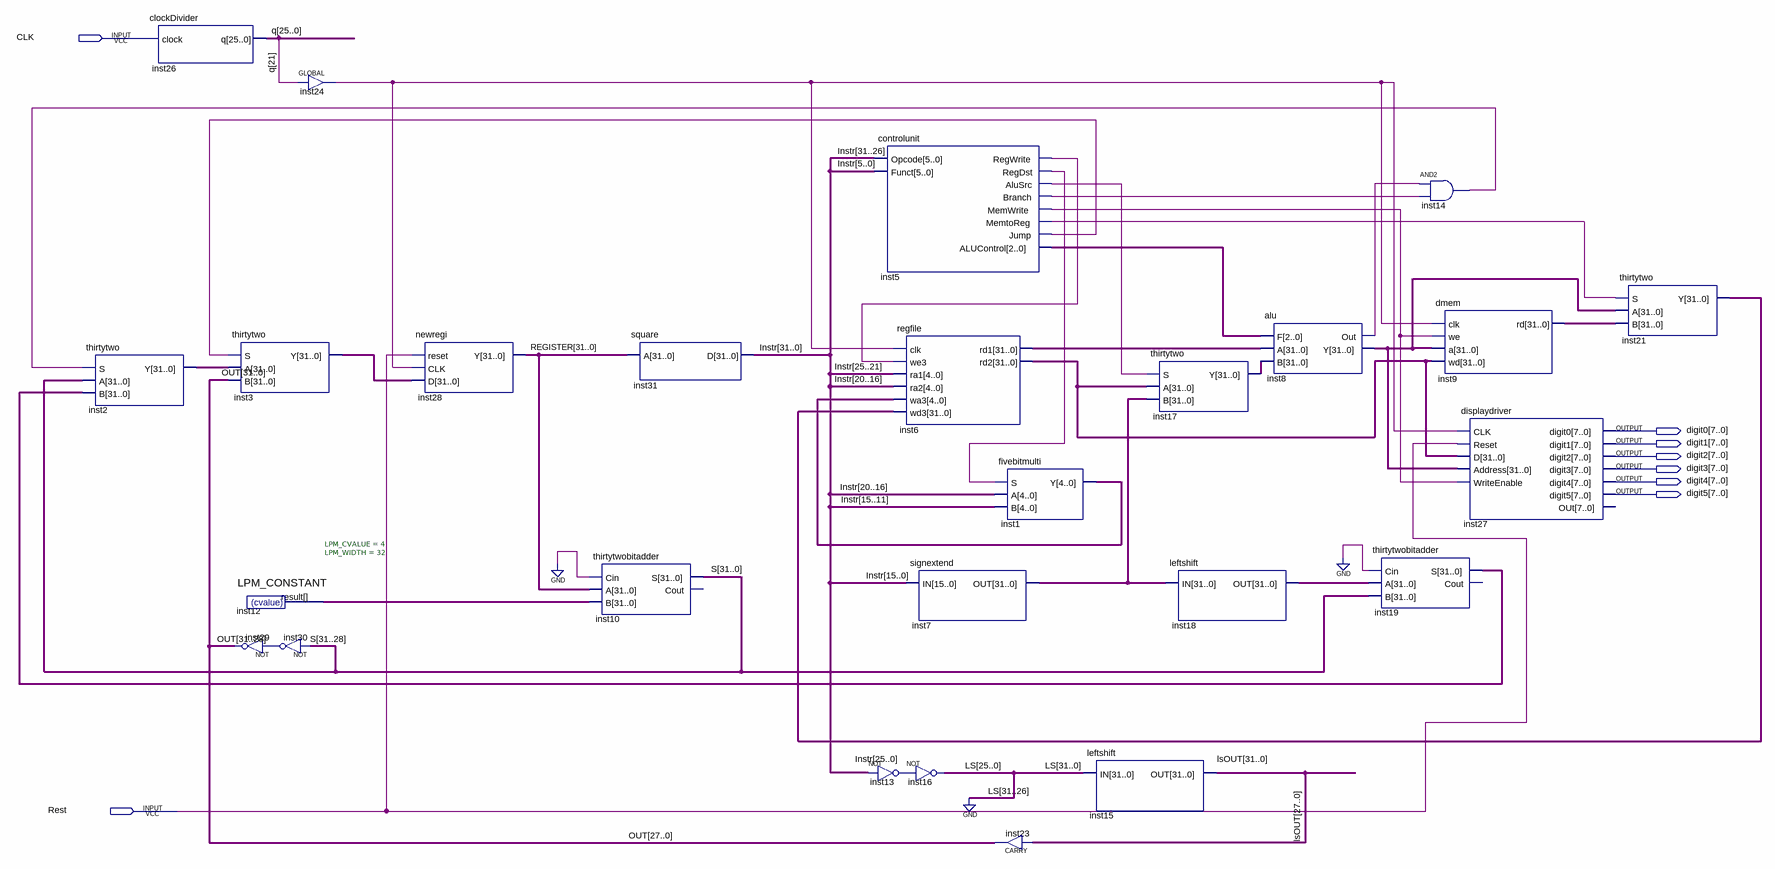
[diagram p0: schematic sheet]
// Quartus schematic processor.bdf as structural Verilog: 26 symbols, 8 pins
module processor (
  input  CLK,
  input  Rest,
  output [7:0] digit0,
  output [7:0] digit1,
  output [7:0] digit2,
  output [7:0] digit3,
  output [7:0] digit4,
  output [7:0] digit5
);

  wire inst5_alusrc, inst5_branch, inst5_jump, inst5_memtoreg, inst5_memwrite, inst5_regdst, inst5_regwrite,
       inst8_out, inst13_out, inst14_out, inst24_out, inst30_out;
  wire [2:0] inst5_alucontrol;
  wire [4:0] inst1_y;
  wire [25:0] LS, q;
  wire [31:0] inst2_y, inst3_y, inst6_rd1, inst6_rd2, inst7_out, inst8_y, inst9_rd, inst12_result, inst17_y,
       inst18_out, inst19_s, inst21_y, Instr, lsOUT, OUT, REGISTER, S;

  thirtytwo inst2 (.S(inst14_out), .A(S), .B(inst19_s), .Y(inst2_y));
  clockDivider inst26 (.clock(CLK), .q(q));
  thirtytwo inst3 (.S(inst5_jump), .A(inst2_y), .B(OUT), .Y(inst3_y));
  LPM_CONSTANT #(.LPM_CVALUE(4), .LPM_WIDTH(32)) inst12 (.result(inst12_result));
  assign OUT[31:28] = ~{4{inst30_out}};  // NOT inst29, 4 bits wide
  GLOBAL inst24 (.IN(q[21]), .OUT(inst24_out));
  assign inst30_out = ~S[31:28];  // NOT inst30, 4 bits wide
  newregi inst28 (.reset(Rest), .CLK(inst24_out), .D(inst3_y), .Y(REGISTER));
  thirtytwobitadder inst10 (.Cin(1'b0), .A(REGISTER), .B(inst12_result), .S(S));  // open: Cout
  square inst31 (.A(REGISTER), .D(Instr));
  controlunit inst5 (
    .Opcode(Instr[31:26]), .Funct(Instr[5:0]), .RegWrite(inst5_regwrite), .RegDst(inst5_regdst),
    .AluSrc(inst5_alusrc), .Branch(inst5_branch), .MemWrite(inst5_memwrite), .MemtoReg(inst5_memtoreg),
    .Jump(inst5_jump), .ALUControl(inst5_alucontrol));
  regfile inst6 (
    .clk(inst24_out), .we3(inst5_regwrite), .ra1(Instr[25:21]), .ra2(Instr[20:16]), .wa3(inst1_y),
    .wd3(inst21_y), .rd1(inst6_rd1), .rd2(inst6_rd2));
  signextend inst7 (.IN(Instr[15:0]), .OUT(inst7_out));
  assign inst13_out = ~Instr[25:0];  // NOT inst13, 26 bits wide
  assign LS = ~{26{inst13_out}};  // NOT inst16, 26 bits wide
  fivebitmulti inst1 (.S(inst5_regdst), .A(Instr[20:16]), .B(Instr[15:11]), .Y(inst1_y));
  CARRY inst23[27:0] (.IN(lsOUT[27:0]), .OUT(OUT[27:0]));
  leftshift inst15 (.IN({{6{1'b0}}, LS}), .OUT(lsOUT));
  thirtytwo inst17 (.S(inst5_alusrc), .A(inst6_rd2), .B(inst7_out), .Y(inst17_y));
  leftshift inst18 (.IN(inst7_out), .OUT(inst18_out));
  alu inst8 (.F(inst5_alucontrol), .A(inst6_rd1), .B(inst17_y), .Out(inst8_out), .Y(inst8_y));
  thirtytwobitadder inst19 (.Cin(1'b0), .A(inst18_out), .B(S), .S(inst19_s));  // open: Cout
  and inst14 (inst14_out, inst8_out, inst5_branch);
  dmem inst9 (.clk(inst24_out), .we(inst5_memwrite), .a(inst8_y), .wd(inst6_rd2), .rd(inst9_rd));
  displaydriver inst27 (
    .CLK(inst24_out), .Reset(Rest), .D(inst6_rd2), .Address(inst8_y), .WriteEnable(inst5_memwrite),
    .digit0(digit0), .digit1(digit1), .digit2(digit2), .digit3(digit3), .digit4(digit4), .digit5(digit5));  // open: OUt
  thirtytwo inst21 (.S(inst5_memtoreg), .A(inst8_y), .B(inst9_rd), .Y(inst21_y));
endmodule
